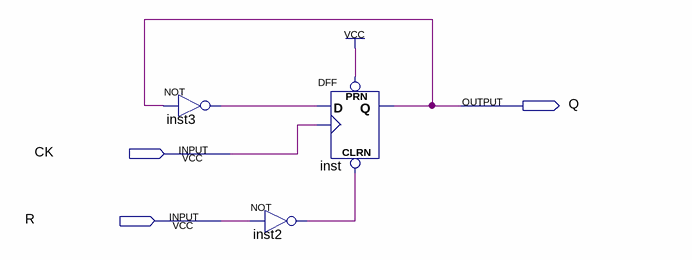
[diagram p0: schematic sheet]
// Quartus schematic div_freq.bdf as structural Verilog: 3 symbols, 3 pins
module div_freq (
  input  CK,
  input  R,
  output Q
);

  wire inst2_out, inst3_out;

  not inst3 (inst3_out, Q);
  DFF inst (.CLRN(inst2_out), .CLK(CK), .D(inst3_out), .PRN(1'b1), .Q(Q));
  not inst2 (inst2_out, R);
endmodule
